# Altium project motor controller board.PrjPcb
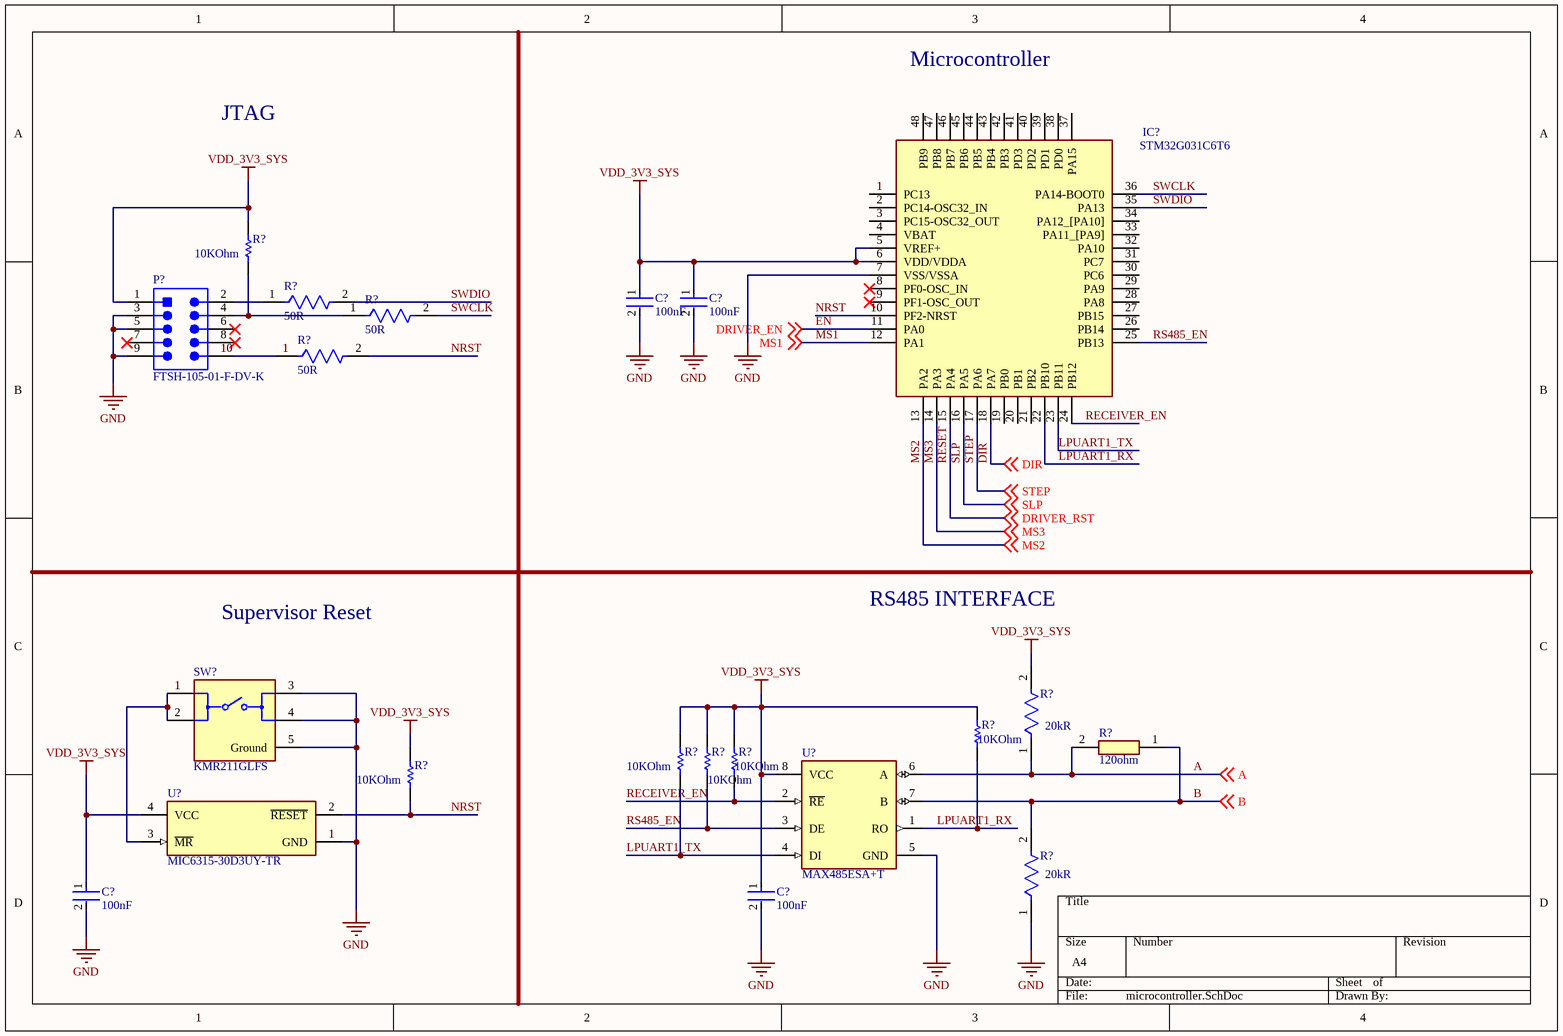
[diagram p0: microcontroller.SchDoc]
4 sheets, 56 parts. Net scope: global (net labels, ports and power ports of the same name join across sheets).
Sheets:
  microcontroller.SchDoc
  Driver.SchDoc
  PowerSupply.SchDoc
  Plugs.SchDoc

## Sheet microcontroller.SchDoc
size A4; SheetNumber: 1; SheetTotal: 3; SPICEModelCacheLTWMIPXS: <root> / <DocumentId>LTWMIPXS</DocumentId> / </root>

### Parts
(Parts that share a designator on the sheet are numbered #1, #2 ... from top to bottom, then left to right.)
C?#1  Capacitance: 100nF  [FP-CGA3E-0_3-0_1-IPC_A]  (hidden comment: CGA3E2X7R1H104K080AA)
C?#2  Capacitance: 100nF  [FP-CGA3E-0_3-0_1-IPC_A]  (hidden comment: CGA3E2X7R1H104K080AA)
C?#3  Capacitance: 100nF  [FP-CGA3E-0_3-0_1-IPC_A]  (hidden comment: CGA3E2X7R1H104K080AA)
C?#4  Capacitance: 100nF  [FP-CGA3E-0_3-0_1-IPC_A]  (hidden comment: CGA3E2X7R1H104K080AA)
IC?#1  STM32G031C6T6  [QFP50P900X900X160-48N]
P?  FTSH-105-01-F-DV-K  [SMTC-FTSH-105-01-L-DV-K_V]
R?#1  Resistance: 10KOhm  [RESC1609X55X30LL15T15]  (hidden comment: ERJ3EKF1002V)
R?#2  Resistance: 50R  [FP-FC0603-MFG]  (hidden comment: FC0603E50R0BTBST1)
R?#3  Resistance: 50R  [FP-FC0603-MFG]  (hidden comment: FC0603E50R0BTBST1)
R?#4  Resistance: 50R  [FP-FC0603-MFG]  (hidden comment: FC0603E50R0BTBST1)
R?#5  Resistance: 10KOhm  [RESC1609X55X30LL15T15]  (hidden comment: ERJ3EKF1002V)
R?#6  value 120ohm  [RESC1608X55N]  (hidden comment: CRG0603F120R)
R?#7  Resistance: 20kR  [FP-RC0603-0_55-IPC_B]  (hidden comment: RC0603FR-0720KL)
R?#8  Resistance: 10KOhm  [RESC1609X55X30LL15T15]  (hidden comment: ERJ3EKF1002V)
R?#9  Resistance: 10KOhm  [RESC1609X55X30LL15T15]  (hidden comment: ERJ3EKF1002V)
R?#10  Resistance: 10KOhm  [RESC1609X55X30LL15T15]  (hidden comment: ERJ3EKF1002V)
R?#11  Resistance: 10KOhm  [RESC1609X55X30LL15T15]  (hidden comment: ERJ3EKF1002V)
R?#12  Resistance: 20kR  [FP-RC0603-0_55-IPC_B]  (hidden comment: RC0603FR-0720KL)
SW?  KMR211GLFS  [FP-KMR211GLFS-MFG]
U?#1  MAX485ESA+T  [FP-S8-2-MFG]
U?#2  MIC6315-30D3UY-TR  [FP-SOT143-4LD-PL-1-MFG]

### Nets
GND: C?#1.2 C?#2.2 C?#3.2 C?#4.2 IC?#1.7(VSS/VSSA) P?.3 P?.5 P?.9 R?#12.1 SW?.3 SW?.4 SW?.5(Ground) U?#1.5(GND) U?#2.1(GND)
VDD_3V3_SYS: C?#1.1 C?#2.1 C?#3.1 C?#4.1 IC?#1.5(VREF+) IC?#1.6(VDD/VDDA) P?.1 R?#1.2 R?#5.2 R?#7.2 R?#8.2 R?#9.2 R?#10.2 R?#11.2 U?#1.8(VCC) U?#2.4(VCC)
A: R?#6.2 R?#7.1 U?#1.6(A) ; off-sheet A
B: R?#6.1 R?#12.2 U?#1.7(B) ; off-sheet B
DIR: IC?#1.18(PA7) ; off-sheet DIR
DRIVER_EN: IC?#1.11(PA0) ; off-sheet DRIVER_EN  [also labelled EN]
DRIVER_RST: IC?#1.15(PA4) ; off-sheet DRIVER_RST  [also labelled RESET]  [project net DRIVER_RESET]
LPUART1_RX: IC?#1.22(PB10) R?#5.1 U?#1.1(RO)
LPUART1_TX: IC?#1.23(PB11) R?#8.1 U?#1.4(DI)
MS1: IC?#1.12(PA1) ; off-sheet MS1
MS2: IC?#1.13(PA2) ; off-sheet MS2
MS3: IC?#1.14(PA3) ; off-sheet MS3
NRST: IC?#1.10(PF2-NRST) R?#4.2 R?#11.1 U?#2.2(~{RESET})
RECEIVER_EN: IC?#1.24(PB12) R?#10.1 U?#1.2(~{RE})
RS485_EN: IC?#1.25(PB13) R?#9.1 U?#1.3(DE)
SLP: IC?#1.16(PA5) ; off-sheet SLP
STEP: IC?#1.17(PA6) ; off-sheet STEP
SWCLK: IC?#1.36(PA14-BOOT0) R?#3.2
SWDIO: IC?#1.35(PA13) R?#2.2
NetP?_2: P?.2 R?#2.1
NetP?_4: P?.4 R?#1.1 R?#3.1
NetP?_10: P?.10 R?#4.1
NetSW?_1: SW?.1 SW?.2 U?#2.3(~{MR})

Not connected (* = marked no-connect by the designer): IC?#1 1(PC13) 2(PC14-OSC32_IN) 3(PC15-OSC32_OUT) 4(VBAT) 8(PF0-OSC_IN)* 9(PF1-OSC_OUT)* 19(PB0) 20(PB1) 21(PB2) 26(PB14) 27(PB15) 28(PA8) 29(PA9) 30(PC6) 31(PC7) 32(PA10) 33(PA11_[PA9]) 34(PA12_[PA10]) 37(PA15) 38(PD0) 39(PD1) 40(PD2) 41(PD3) 42(PB3) 43(PB4) 44(PB5) 45(PB6) 46(PB7) 47(PB8) 48(PB9); P? 6* 7* 8*

### Notes on the sheet
- Microcontroller
- JTAG
- Supervisor Reset
- RS485 INTERFACE

### Library data of the parts
C?#1-C?#4 = CMP-2000-07546-2: Cap Ceramic 100nF 50V X7R 10% Pad SMD 0603 +125°C Automotive T/R; Weight: 7.1E-05oz; Composition: Ceramic; Max Operating Temperature: 125°C; Termination: SMD/SMT; Dielectric: X7R; Length: 1.6mm; Package Quantity: 1; REACH SVHC: No SVHC; Lead Free: Lead Free; Case Code (Metric): 1608; Min Operating Temperature: -55°C; Packaging: Tape and Reel; Tolerance: 10%; Voltage Rating: 50V; Case Code (Imperial): 0603; Case/Package: 0603; Voltage Rating (DC): 50V; Depth: 0.8mm; Radiation Hardening: No; Ratings: AEC-Q200; Mount: Surface Mount; Voltage: 50V; Thickness: 0.035inch; Width: 0.8mm; Height: 0.8mm
IC?#1 = STM32G031C6T6: Integrated Circuit; Manufacturer_Name: STMicroelectronics; Datasheet Link: https://www.st.com/resource/en/datasheet/stm32g031c6.pdf; Height: 1.6mm; Manufacturer_Part_Number: STM32G031C6T6; Mouser Part Number: 511-STM32G031C6T6; Mouser Price/Stock: https://www.mouser.co.uk/ProductDetail/STMicroelectronics/STM32G031C6T6?qs=uwxL4vQweFMtqlIt%2FRk%2Fog%3D%3D; Arrow Part Number: STM32G031C6T6; Arrow Price/Stock: https://www.arrow.com/en/products/stm32g031c6t6/stmicroelectronics?region=nac
P? = CMP-2000-05352-1: Male Header, Pitch 1.27 mm, 2 x 5 Position, Height 6.12 mm, RoHS, Tube; Manufacturer: Samtec; Number of Positions: 10; Connector Type: Header,Shrouded; Number of Positions Loaded: All; Row Spacing: 0.050"(1.27mm); Fastening Type: -; Package Reference: FTSH-105-01-L-DV-K; Termination: Solder; Package URL: http://suddendocs.samtec.com/prints/ftsh-1xx-xx-xxx-dv-xxx-footprint.pdf; Number of Rows: 2; Contact Finish Thickness: 3µin(0.08µm); Contact Type: MalePin; Manufacturer URL: http://www.samtec.com/; Contact Mating Length: 0.120"(3.05mm); Pitch: 0.050"(1.27mm); Series: FTSH; Features: -; Contact Finish: Gold; Color: Black; Family: RectangularConnectors-Headers,MalePins; Datasheet URL: http://suddendocs.samtec.com/prints/ftsh-1xx-xx-xxx-dv-xxx-mkt.pdf; Package Description: Male Header, Pitch 1.27 mm, 2 x 5 Position, Height 5.97 mm, Tail Length 4.32 mm; Mounting Type: SurfaceMount; Datasheet Version: Rev. ET, 10/1995; Category: Connectors,Interconnects; Packaging: Tube
R?#1 R?#5 R?#8-R?#11 = CMP-1012-00623-3: Chip Resistor, 10 KOhm, +/- 1%, 0.1 W, -55 to 155 degC, 0603 (1608 Metric), RoHS, Tape and Reel; Manufacturer: Panasonic; Voltage Rating: 75V; Case\/Package: 0603; Power Rating: 100mW; Temperature Coefficient: 100ppm\/degreesC; Number of Pins: 2; Package Reference: 603; Depth: 0.8mm; Mount: SurfaceMount; Package Description: 2-Pin Surface Mount Device, Body 1.6 x 0.85 mm; Datasheet Version: 02/2017; Length: 1.6mm; Lead Free: LeadFree; Height: 0.45mm; Number of Terminations: 2; Max Power Dissipation: 100mW; Min Operating Temperature: -55degC; Datasheet URL: https://industrial.panasonic.com/cdbs/www-data/pdf/RDA0000/AOA0000C304.pdf; Termination: SMD/SMT; Case Code (Metric): 1608; Case Code (Imperial): 0603; Tolerance: 1%; Max Operating Temperature: 155degC; RoHSCompliant: true; Voltage Rating (DC): 75V; Radiation Hardening: No; Packaging: TapeandReel; Composition: ThickFilm; Mounting Technology: SurfaceMount; Manufacturer URL: http://www.panasonic.com/; Width: 0.031inch; REACH SVHC: NoSVHC; Contact Plating: Tin; Military Standard: Not; Package Quantity: 1
R?#2-R?#4 = CMP-2000-03661-2: RES SMD 50 OHM 0.1% 1/8W 0603; Max Power Dissipation: 125mW; Voltage Rating (DC): 50V; Frequency: 20GHz; Temperature Coefficient: 25ppm/°C; Construction: Rectangular; Length: 0.064inch; Case/Package: 0603; Mount: Surface Mount; Case Code (Imperial): 0603; Military Standard: Not; Height: 0.015inch; RoHS Compliant: Yes; Depth: 0.81mm; Voltage Rating: 50V; Series: FC; Resistance Tolerance: 0.1%; Number of Terminations: 2; Min Operating Temperature: -55°C; Max Operating Temperature: 125°C; Power Rating: 125mW; Resistor Type: Thin Film; Termination: SMD/SMT; Packaging: Tape and Reel; Number of Pins: 2; Radiation Hardening: No; Width: 0.8mm; Tolerance: 0.1%; Contact Plating: Tin; Package Quantity: 1; Case Code (Metric): 1608
R?#6 = CRG0603F120R: Resistor; Manufacturer_Name: TE Connectivity; Datasheet Link: http://docs-europe.electrocomponents.com/webdocs/13d1/0900766b813d116f.pdf; Height: 0.55mm; Manufacturer_Part_Number: CRG0603F120R; Mouser Part Number: 279-CRG0603F120R; Mouser Price/Stock: https://www.mouser.co.uk/ProductDetail/TE-Connectivity-Holsworthy/CRG0603F120R?qs=VHcS2MTj4gbLzmSJaKDB9g%3D%3D; Arrow Part Number: CRG0603F120R; Arrow Price/Stock: https://www.arrow.com/en/products/crg0603f120r/te-connectivity
R?#7 R?#12 = CMP-2000-06932-2: RES 20K OHM 1% 1/10W 0603; Voltage Rating: 50V; Temperature Coefficient: 100ppm/°C; Power Rating: 100mW; Height: 0.022inch; REACH SVHC: No SVHC; Case Code (Metric): 1608; Depth: 0.8mm; Tolerance: 1%; Min Operating Temperature: -55°C; Series: RC; RoHS Compliant: Yes; Resistor Type: Thick Film; Max Power Dissipation: 100mW; Features: Moisture Resistant; Max Operating Temperature: 155°C; Package Quantity: 1; Size Code: 0603; Packaging: Tape and Reel; Width: 0.031inch; Length: 0.063inch; Military Standard: Not; Technology: THICK FILM; Number of Terminations: 2; Termination: SMD/SMT; Construction: Rectangular; Case/Package: 0603; Number of Pins: 2; Lead Free: Lead Free; Voltage Rating (DC): 50V; Resistance Tolerance: 1%; Case Code (Imperial): 0603
SW? = CMP-10040-000023-1: SWITCH TACTILE SPST-NO 0.05A 32V; Switch Function: Off-Mom; Throw Configuration: SPST; Switch Travel: 0.2mm; Current Rating: 50mA; Illumination Type: Non-Illuminated; Actuator Length: 0.5mm; Power Rating: 1W; Operating Force: 1.2N; Actuator Type: Standard; Mechanical Life: 200000Cycles; REACH SVHC: No SVHC; Voltage Rating (DC): 32V; Length: 2.8mm; Min Operating Temperature: -40°C; Mount: Surface Mount; Max Voltage Rating (DC): 32V; Width: 2.8mm; Depth: 4.6mm; Packaging: Tape and Reel; Lead Free: Lead Free; Contact Material: Silver; Termination: Gull Wing; Package Quantity: 1; Contact Current Rating: 50mA; Orientation: Straight; Max Operating Temperature: 85°C; Radiation Hardening: No; Max Current Rating: 50mA; Contact Plating: Silver
U?#1 = CMP-05679-000009-1: IC TRANSCEIVER HALF 1/1 8SOIC; Manufacturer: Maxim Integrated; Min Supply Voltage: 4.75V; Nominal Supply Current: 0.5mA; Number Of Transmitters: 1; Data Rate: 2.5Mbits/s; Interface: RS-485,RS-422; Standoff Height: 0.1mm; Max Supply Voltage: 5.25V; Simplex Duplex: Half-Duplex; Package: S8-2; Temperature: -40°C to +85°C; Device Class L1: Integrated Circuits (ICs); Footprint Url: https://pdfserv.maximintegrated.com/land_patterns/90-0096.PDF; ComponentLink2URL: https://datasheets.maximintegrated.com/en/ds/MAX1487-MAX491.pdf; Height: 1.75mm; Mouser Description: RS-422/RS-485 Interface IC RS-485/RS-422 Transceiver; Octopart: https://octopart.com/max485esa%2Bt-maxim+integrated-40011239; RoHS: TRUE; ComponentLink2Description: Datasheet; Temperature Range Low: -40°C; Number Of Receivers: 1; Manufacturer Part Number: MAX485ESA+T; Ipc Land Pattern Name: SOIC127P600X155-8; Device Class L3: RS-232 / RS-422 / RS-485 Interface ICs; Automotive: No; Digikey Description: IC TRANSCEIVER HALF 1/1 8SOIC; Temperature Range High: +85°C; Category: IC; Device Class L2: Interface ICs; Lead Free: Yes
U?#2 = CMP-06326-000025-1: IC SUPERVISOR 1 CHANNEL SOT143; Max Reset Threshold Voltage: 3.08V; Max Power Dissipation: 320mW; Watchdog Timer: No; Reset: Active Low; Reset Timeout: 140ms; Min Reset Threshold Voltage: 2.92V; Threshold Voltage: 3V; Operating Supply Current: 5uA; Max Supply Voltage: 5.5V; Number of Elements: 1; Min Supply Voltage: 1V; Power Dissipation: 320mW; Packaging: Tape and Reel; Max Operating Temperature: 85°C; Radiation Hardening: No; Series: -; Type: Simple Reset/Power-On Reset; Case/Package: SOT-143; RoHS Compliant: Yes; Min Operating Temperature: -40°C; Number of Pins: 4; Length: 3.05mm; Mount: Surface Mount; Lead Free: Lead Free; Width: 1.4mm; Reach SVHC Compliant: Yes; Height: 1.02mm; Number of Voltages Monitored: 1

## Sheet Driver.SchDoc
size A4; SheetNumber: 2; SheetTotal: 3; SPICEModelCacheOKJMLVYT: <root> / <DocumentId>OKJMLVYT</DocumentId> / <CacheFrame Number="0"> / <Model Name="umk316abj475_d-t" Kind="CKT"> / <Text>* UMK316ABJ475_D-T     SPICE MODEL  ( General Type ) / *-------------------------------------------------------------------------------------------------------- / * Model Generated by TAIYO YUDEN Corporation (http://www.ty-top.com) / * Version 1.0 / * TAIYO YUDEN Control No. 170508_100817 / * Copyright(c) 2012 TAIYO YUDEN CO.,LTD. All Rights Reserved. / *-------------------------------------------------------------------------------------------------------- / * / * Products Name : Multilayer Ceramic Capacitors / * / * Characteristics : / *     Capacitance : 4.7 uF , Rated Voltage : 50V , TCC : X5R / *     Case Size : 3.2 x 1.6 / 0.126 x 0.063 [mm/inch] , Thickness : 0.85 / 0.033 [mm/inch] / *     (Conditions: Temperature = 25 degC , DC Bias Current/Voltage = 0A / 0V) / * / * Frequency Range : 40Hz - 3GHz / * / * External Node Assignments : / * / *  1  o---| |---o  2 / * / *-------------------------------------------------------------------------------------------------------- / .SubCkt UMK316ABJ475_D-T 1 2 / **************************** / C0 1 110 4.046u / Cm 1 101 0.35498u / C1 101 102 0.72942u / Rc1 101 102 1.4231k / C2 102 103 0.27925u / Rc2 102 103 264.97 / C3 103 110 8383.9p / Rc3 103 110 5.6062 / C2m 1 301 0.48206u / C21 301 302 2.0783u / Rc21 301 302 4.5272k / C22 302 303 1.8889u / Rc22 302 303 3.5092k / C23 303 304 0.95238u / Rc23 303 304 5.7814k / C24 304 305 1.2242u / Rc24 304 305 227.36 / C25 305 306 0.82814u / Rc25 305 306 293.28 / C26 306 307 0.36607u / Rc26 306 307 80.665 / C27 307 308 0.030054u / Rc27 307 308 60.542 / C28 308 309 0.071245u / Rc28 308 309 14.818 / C29 309 110 1452.9p / Rc29 309 110 9.6886 / Rp0 1 110 21.2765957446809Meg / L0 110 120 0.27785n / Lm 120 130 0.31876n / L1 120 121 0.29686n / RL1 121 130 0.31082 / L2 120 122 0.41816n / RL2 122 130 0.37915 / L3 120 123 0.94452n / RL3 123 130 0.84341 / CR 120 124 0.42709u / LR 124 125 0.73026n / RR 125 130 79.488m / CL 130 140 0.50681p / LL 130 140 0.22381n / RL 130 140 31.219 / Rs 140 2 7.1209m / **************************** / .ends UMK316ABJ475_D-T</Text> / </Model> / </CacheFrame> / </root>
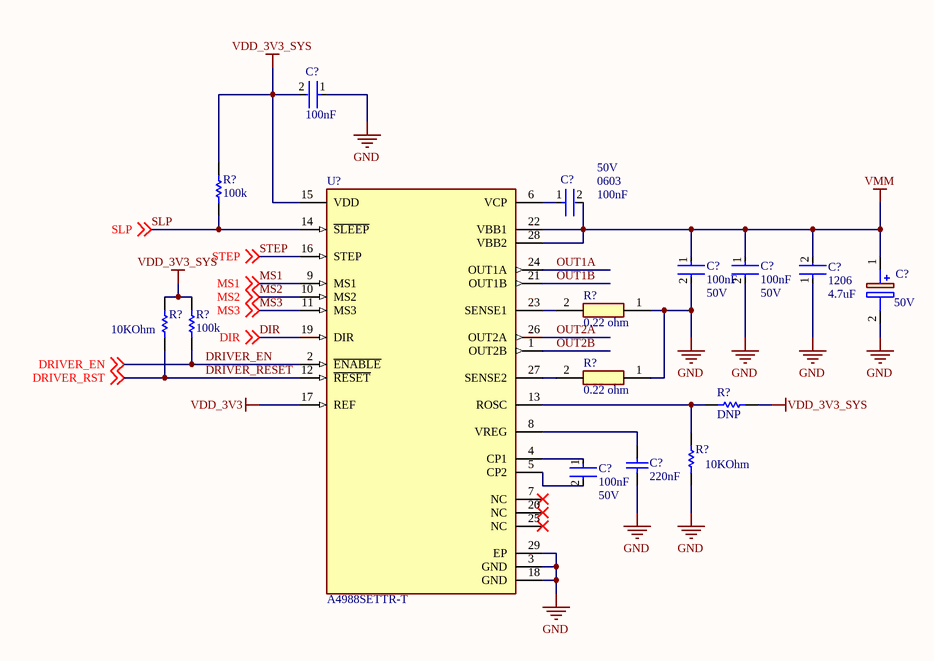
[diagram p1: Driver.SchDoc]

### Parts
(Parts that share a designator on the sheet are numbered #1, #2 ... from top to bottom, then left to right.)
C?#5  Capacitance: 100nF  [FP-CGA3E-0_3-0_1-IPC_A]  (hidden comment: CGA3E2X7R1H104K080AA)
C?#6  Voltage Rating: 50V  Case Code (Imperial): 0603  Capacitance: 100nF  [FP-CGA3E-0_3-0_1-IPC_A]  (hidden comment: CGA3E2X7R1H104K080AA)
C?#7  Capacitance: 100nF  Voltage Rating (DC): 50V  [FP-CGA3E-0_3-0_1-IPC_A]  (hidden comment: CGA3E2X7R1H104K080AA)
C?#8  Capacitance: 100nF  Voltage Rating (DC): 50V  [FP-CGA3E-0_3-0_1-IPC_A]  (hidden comment: CGA3E2X7R1H104K080AA)
C?#9  voltage rating: 50V  [EEE0JA331XP]  (hidden comment: EEE-FK1H470XP)
C?#10  Case/Package: 1206  Capacitance: 4.7uF  [FP-1206-L_3_2_0_2-W_1_6_0-IPC_B]  (hidden comment: UMK316ABJ475KD-T)
C?#11  Capacitance: 100nF  Voltage Rating (DC): 50V  [FP-CGA3E-0_3-0_1-IPC_A]  (hidden comment: CGA3E2X7R1H104K080AA)
C?#12  Parameter 1: 220nF  [CAPC1608X87X35NL15T15]  (hidden comment: C0603C224K8NACTU)
R?#13  value 100k  [RESC1609X55X30ML10T20]  (hidden comment: TNPW0603100KBEEN)
R?#14  value 100k  [RESC1609X55X30ML10T20]  (hidden comment: TNPW0603100KBEEN)
R?#15  value 0.22 ohm  [RESC6432X84N]  (hidden comment: RLP73K3AR22JTE)
R?#16  Resistance: 10KOhm  [RESC1609X55X30LL15T15]  (hidden comment: ERJ3EKF1002V)
R?#17  value 0.22 ohm  [RESC6432X84N]  (hidden comment: RLP73K3AR22JTE)
R?#18  Resistance: DNP  [RESC1608X55X25ML10T15]  (hidden comment: RC0603JR-070RL)  (net tie, no BOM)
R?#19  Resistance: 10KOhm  [RESC1609X55X30LL15T15]  (hidden comment: ERJ3EKF1002V)
U?#3  A4988SETTR-T  [FP-ET-28-MFG]

### Nets
GND: C?#5.1 C?#7.2 C?#8.2 C?#9.2(-) C?#10.1 C?#12.2 R?#15.1 R?#17.1 R?#19.1 U?#3.3(GND) U?#3.18(GND) U?#3.29(EP)
VDD_3V3: U?#3.17(REF)
VDD_3V3_SYS: C?#5.2 R?#13.1 R?#14.1 R?#16.2 R?#18.2 U?#3.15(VDD)
VMM: C?#6.2 C?#7.1 C?#8.1 C?#9.1(+) C?#10.2 U?#3.22(VBB1) U?#3.28(VBB2)
DIR: U?#3.19(DIR) ; off-sheet DIR
DRIVER_EN: R?#14.2 U?#3.2(~{ENABLE}) ; off-sheet DRIVER_EN
DRIVER_RESET: R?#16.1 U?#3.12(~{RESET}) ; off-sheet DRIVER_RST  [also labelled DRIVER_RST]
MS1: U?#3.9(MS1) ; off-sheet MS1
MS2: U?#3.10(MS2) ; off-sheet MS2
MS3: U?#3.11(MS3) ; off-sheet MS3
OUT1A: U?#3.24(OUT1A)
OUT1B: U?#3.21(OUT1B)
OUT2A: U?#3.26(OUT2A)
OUT2B: U?#3.1(OUT2B)
SLP: R?#13.2 U?#3.14(~{SLEEP}) ; off-sheet SLP
STEP: U?#3.16(STEP) ; off-sheet STEP
NetC?#6_1: C?#6.1 U?#3.6(VCP)
NetC?#11_1: C?#11.1 U?#3.4(CP1)
NetC?#11_2: C?#11.2 U?#3.5(CP2)
NetC?#12_1: C?#12.1 U?#3.8(VREG)
NetR?#15_2: R?#15.2 U?#3.23(SENSE1)
NetR?#17_2: R?#17.2 U?#3.27(SENSE2)
NetR?#18_1: R?#18.1 R?#19.2 U?#3.13(ROSC)

Not connected (* = marked no-connect by the designer): U?#3 7(NC)* 20(NC)* 25(NC)*

### Library data of the parts
C?#5-C?#8 C?#11 = CMP-2000-07546-2: as C?#1 on sheet microcontroller; Weight: 7.1E-05oz; Composition: Ceramic; Max Operating Temperature: 125°C; Termination: SMD/SMT; Dielectric: X7R; Length: 1.6mm; Package Quantity: 1; REACH SVHC: No SVHC; Lead Free: Lead Free; Case Code (Metric): 1608; Min Operating Temperature: -55°C; Packaging: Tape and Reel; Tolerance: 10%; Case/Package: 0603; Depth: 0.8mm; Radiation Hardening: No; Ratings: AEC-Q200; Mount: Surface Mount; Voltage: 50V; Thickness: 0.035inch; Width: 0.8mm; Height: 0.8mm
  C?#5: Voltage Rating: 50V; Case Code (Imperial): 0603; Voltage Rating (DC): 50V
  C?#6: Voltage Rating (DC): 50V; Parameter 1: *
  C?#7 C?#8 C?#11: Voltage Rating: 50V; Case Code (Imperial): 0603
C?#9 = EEE-FK1H470XP: Capacitor Polarised; Manufacturer_Name: Panasonic; Datasheet Link: http://industrial.panasonic.com/cdbs/www-data/pdf/RDE0000/ABA0000C1181.pdf; Height: 7.8mm; Manufacturer_Part_Number: EEE-FK1H470XP; Mouser Part Number: 667-EEE-FK1H470XP; Mouser Price/Stock: https://www.mouser.co.uk/ProductDetail/Panasonic/EEE-FK1H470XP?qs=qE6bgDGEOCtuVppQsylaxg%3D%3D; Arrow Part Number: EEE-FK1H470XP; Arrow Price/Stock: https://www.arrow.com/en/products/eee-fk1h470xp/panasonic?region=europe; Parameter 2: *
C?#10 = CMP-14477-000107-2: None; Voltage Rating (DC): 50V; Tolerance: 10%; Dielectric: X5R; Mount: Surface Mount; RoHS Compliant: Yes; Height: 0.85mm; Case Code (Metric): 3216; Construction: Flat; Resistor Type: Ceramic; Number of Pins: 2; Depth: 1.6mm; Packaging: Tape and Reel; Max Operating Temperature: 85°C; Length: 3.2mm; Thickness: 0.037inch; Voltage Rating: 50V; Weight: 0.000571oz; Width: 0.063inch; Case Code (Imperial): 1206; Package Quantity: 1; Termination: SMD/SMT; Series: M; Radiation Hardening: No; Min Operating Temperature: -55°C
C?#12 = CMP-2006-03148-1: Manufacturer: Kemet; Part Number: C0603C224K8NACTU
R?#13 R?#14 = CMP-2000-03686-1: Manufacturer: Vishay Dale; Part Number: TNPW0603100KBEEN
R?#15 R?#17 = RLP73K3AR22JTE: Resistor; Manufacturer_Name: TE Connectivity; Datasheet Link: https://www.te.com/commerce/DocumentDelivery/DDEController?Action=showdoc&DocId=Customer+Drawing%7F2176058%7FBA%7Fpdf%7FEnglish%7FENG_CD_2176058_BA.pdf%7F3-2176058-3; Height: 0.84mm; Manufacturer_Part_Number: RLP73K3AR22JTE; Arrow Part Number: RLP73K3AR22JTE; Arrow Price/Stock: https://www.arrow.com/en/products/rlp73k3ar22jte/te-connectivity
R?#16 R?#19 = CMP-1012-00623-3: as R?#1 on sheet microcontroller; Number of Pins: 2; Package Reference: 603; Depth: 0.8mm; Mount: SurfaceMount; Package Description: 2-Pin Surface Mount Device, Body 1.6 x 0.85 mm; Datasheet Version: 02/2017; Length: 1.6mm; Lead Free: LeadFree; Height: 0.45mm; Number of Terminations: 2; Max Power Dissipation: 100mW; Min Operating Temperature: -55degC; Datasheet URL: https://industrial.panasonic.com/cdbs/www-data/pdf/RDA0000/AOA0000C304.pdf; Termination: SMD/SMT; Case Code (Metric): 1608; Case Code (Imperial): 0603; Tolerance: 1%; Max Operating Temperature: 155degC; RoHSCompliant: true; Voltage Rating (DC): 75V; Radiation Hardening: No; Packaging: TapeandReel; Composition: ThickFilm; Mounting Technology: SurfaceMount; Manufacturer URL: http://www.panasonic.com/; Width: 0.031inch; REACH SVHC: NoSVHC; Contact Plating: Tin; Military Standard: Not; Package Quantity: 1
R?#18 = CMP-2100-03667-1: Chip Resistor, 0 Ohm, +/- 5%, 0.1 W, -55 to 155 degC, 0603 (1608 Metric), RoHS, Tape and Reel; Manufacturer: Yageo; Temperature Coefficient: 200ppm/degreesC; Voltage Rating: 50V; Power Rating: 100mW; Width: 0.8mm; Max Operating Temperature: 155degC; Tolerance: 5%; Package Reference: 0603; Height: 0.45mm; Depth: 0.8mm; Package Description: 2-Pin Surface Mount Device, Body 1.6 x 0.8 mm; Termination: SMD/SMT; Package Quantity: 5000; Case/Package: 0603; Case Code (Imperial): 0603; Radiation Hardening: No; Number of Pins: 2; Length: 1.6mm; Lead Free: LeadFree; Voltage Rating (DC): 50V; Military Standard: Not; Datasheet URL: http://www.yageo.com/NewPortal/yageodocoutput?fileName=/pdf/R-Chip/PYu-RC_Group_51_RoHS_L_5.pdf; Manufacturer URL: http://www.yageo.com/; Packaging: TapeandReel; Case Code (Metric): 1608; Min Operating Temperature: -55degC; Composition: ThickFilm; RoHSCompliant: true; Contact Plating: Tin; Datasheet Version: Rev. 5, 10/2016; REACH SVHC: NoSVHC
U?#3 = CMP-1742-00003-2: IC MTR DRVR BIPOLAR 3-5.5V 28QFN; Number of Outputs: 1; Motor Type: Stepper; Output Current: 2A; Min Supply Voltage: 8V; Output Voltage: 35V; Package Quantity: 1; Max Operating Temperature: 85°C; Case/Package: QFN EP; Mount: Surface Mount; Packaging: Tape and Reel; Radiation Hardening: No; REACH SVHC: No SVHC; Min Operating Temperature: -20°C; Max Supply Voltage: 35V; Number of Pins: 28

## Sheet PowerSupply.SchDoc
size A4; SheetNumber: 3; SheetTotal: 3
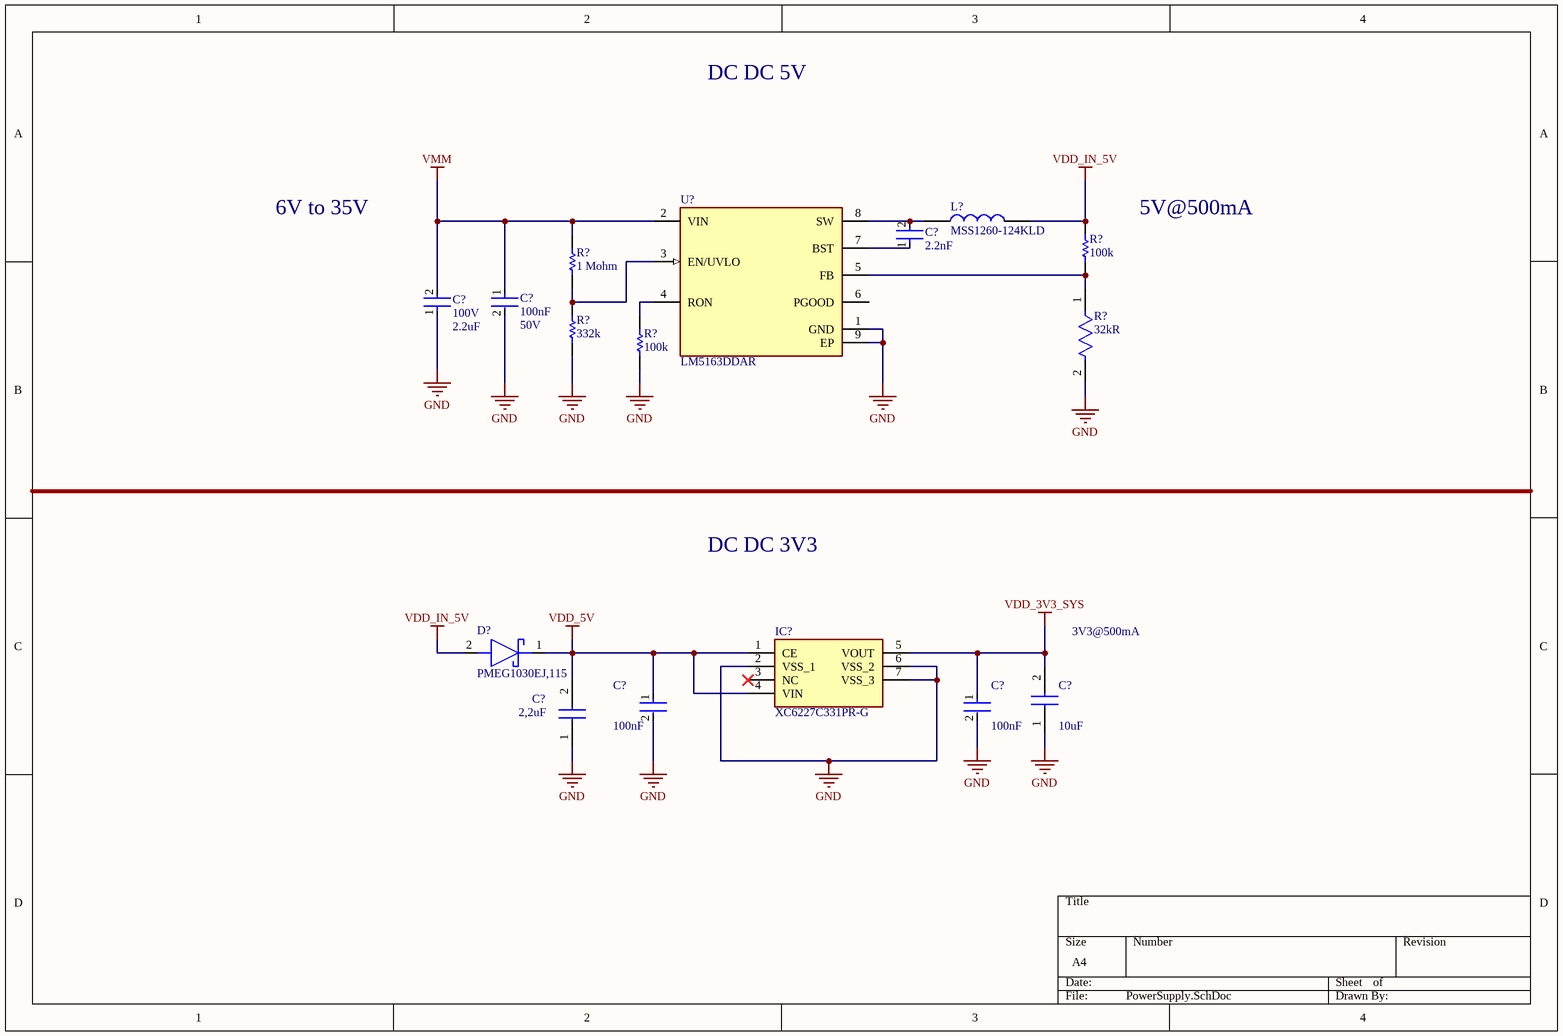
[diagram p2: PowerSupply.SchDoc]

### Parts
(Parts that share a designator on the sheet are numbered #1, #2 ... from top to bottom, then left to right.)
C?#13  Capacitance: 2.2nF  [FP-GCM155-0_05-IPC_C]  (hidden comment: GCM155R71H222KA37D)
C?#14  Capacitance: 100nF  Voltage Rating (DC): 50V  [FP-CGA3E-0_3-0_1-IPC_A]  (hidden comment: CGA3E2X7R1H104K080AA)
C?#15  Voltage Rating: 100V  Capacitance: 2.2uF  [FP-CGA6P-IPC_B]  (hidden comment: CGA6N3X7R2A225K230AB)
C?#16  Capacitance: 100nF  [FP-CGA3E-0_3-0_1-IPC_B]  (hidden comment: CGA3E2X7R1H104K080AA)
C?#17  Capacitance: 100nF  [FP-CGA3E-0_3-0_1-IPC_B]  (hidden comment: CGA3E2X7R1H104K080AA)
C?#18  value 10uF  [C0805]  (hidden comment: C0805C106K4PACTU)
C?#19  value 2,2uF  [CAPC2012X135N]  (hidden comment: GRM21BR60J225KA01L)
D?  PMEG1030EJ,115  [SODFL2512X80N]
IC?#2  XC6227C331PR-G  [XC6227C501PRG]
L?  MSS1260-124KLD  [INDPM122123X620N]
R?#20  value 100k  [RESC1609X55X30ML10T20]  (hidden comment: TNPW0603100KBEEN)
R?#21  value 1 Mohm  [RESC1608X55X25LL10T15]  (hidden comment: RC0603FR-071ML)
R?#22  Resistance: 32kR  [FP-RN731J-IPC_B]  (hidden comment: RN731JTTD3202F100)
R?#23  value 332k  [RESC1608X55X25NL10T15]  (hidden comment: RC0603FR-07332KL)
R?#24  value 100k  [RESC1609X55X30ML10T20]  (hidden comment: TNPW0603100KBEEN)
U?#4  LM5163DDAR  [FP-DDA0008E-IPC_C]

### Nets
GND: C?#14.2 C?#15.1 C?#16.2 C?#17.2 C?#18.1 C?#19.1 IC?#2.2(VSS_1) IC?#2.6(VSS_2) IC?#2.7(VSS_3) R?#22.2 R?#23.2 R?#24.2 U?#4.1(GND) U?#4.9(EP)
VDD_3V3_SYS: C?#17.1 C?#18.2 IC?#2.5(VOUT)
VDD_5V: C?#16.1 C?#19.2 D?.1(K) IC?#2.1(CE) IC?#2.4(VIN)
VDD_IN_5V: D?.2(A) L?.2 R?#20.1
VMM: C?#14.1 C?#15.2 R?#21.1 U?#4.2(VIN)
NetC?#13_1: C?#13.1 U?#4.7(BST)
NetC?#13_2: C?#13.2 L?.1 U?#4.8(SW)
NetR?#20_2: R?#20.2 R?#22.1 U?#4.5(FB)
NetR?#21_2: R?#21.2 R?#23.1 U?#4.3(EN/UVLO)
NetR?#24_1: R?#24.1 U?#4.4(RON)

Not connected (* = marked no-connect by the designer): IC?#2 3(NC)*; U?#4 6(PGOOD)

### Notes on the sheet
- DC DC 5V
- 6V to 35V
- 5V@500mA
- DC DC 3V3
- 3V3@500mA

### Library data of the parts
C?#13 = CMP-2008-03727-2: Ceramic Capacitor for Automotive 2.2nF ±10% 50VDC X7R 0402 Paper T/R; Voltage: 50V; Max Operating Temperature: 125°C; Dielectric: X7R; Height: 0.5mm; Case/Package: 0402; Case Code (Metric): 1005; Min Operating Temperature: -55°C; Packaging: Tape and Reel; Mount: Surface Mount; Depth: 0.5mm; Ratings: AEC-Q200; Lead Free: Lead Free; Radiation Hardening: No; Termination: SMD/SMT; Voltage Rating: 50V; Tolerance: 10%; Length: 1mm; Case Code (Imperial): 0402; Weight: 2.3E-05oz; Package Quantity: 1; Thickness: 0.022inch; Voltage Rating (DC): 50V; Width: 0.02inch
C?#14 C?#16 C?#17 = CMP-2000-07546-2: as C?#1 on sheet microcontroller; Weight: 7.1E-05oz; Composition: Ceramic; Max Operating Temperature: 125°C; Termination: SMD/SMT; Dielectric: X7R; Length: 1.6mm; Package Quantity: 1; REACH SVHC: No SVHC; Lead Free: Lead Free; Case Code (Metric): 1608; Min Operating Temperature: -55°C; Packaging: Tape and Reel; Tolerance: 10%; Voltage Rating: 50V; Case Code (Imperial): 0603; Case/Package: 0603; Depth: 0.8mm; Radiation Hardening: No; Ratings: AEC-Q200; Mount: Surface Mount; Voltage: 50V; Thickness: 0.035inch; Width: 0.8mm; Height: 0.8mm
  C?#16 C?#17: Voltage Rating (DC): 50V; Parameter 1: *
C?#15 = CMP-08246-002435-1: Cap Ceramic 2.2uF 100V X7R 10% Pad SMD 1210 +125°C Automotive T/R; Length: 3.2mm; Width: 0.098inch; Mount: Surface Mount; Ratings: AEC-Q200; Case Code (Imperial): 1210; Case Code (Metric): 3225; Case/Package: 1210; Packaging: Tape and Reel; Thickness: 0.098inch; Max Operating Temperature: 125°C; Depth: 2.5mm; Min Operating Temperature: -55°C; Voltage Rating (DC): 100V; Height: 2.3mm; Weight: 0.000564oz; Package Quantity: 1; Tolerance: 10%; REACH SVHC: No SVHC; Termination: SMD/SMT; Lead Free: Lead Free; Dielectric: X7R; Composition: Ceramic
C?#18 = C0805C106K4PACTU: Capacitor; Manufacturer_Name: KEMET; Datasheet Link: https://content.kemet.com/datasheets/KEM_C1006_X5R_SMD.pdf; Height: 1.1mm; Manufacturer_Part_Number: C0805C106K4PACTU; Mouser Part Number: 80-C0805C106K4P; Mouser Price/Stock: https://www.mouser.co.uk/ProductDetail/KEMET/C0805C106K4PACTU?qs=LOQsJ2JwiRQzQlGR%2F0Z13g%3D%3D; Arrow Part Number: C0805C106K4PACTU; Arrow Price/Stock: https://www.arrow.com/en/products/c0805c106k4pactu/kemet-corporation
C?#19 = GRM21BR60J225KA01L: Capacitor; Manufacturer_Name: Murata Electronics; Datasheet Link: https://www.murata.com/en-global/products/productdetail?partno=GRM21BR60J225KA01%23; Height: 1.35mm; Manufacturer_Part_Number: GRM21BR60J225KA01L; Mouser Part Number: 81-GRM21R60J225KA01L; Mouser Price/Stock: https://www.mouser.co.uk/ProductDetail/Murata-Electronics/GRM21BR60J225KA01L?qs=DJY02EClX9mNbSy8m7mkKA%3D%3D; Arrow Part Number: GRM21BR60J225KA01L; Arrow Price/Stock: https://www.arrow.com/en/products/grm21br60j225ka01l/murata-manufacturing
D? = PMEG1030EJ,115: Schottky Diode; Manufacturer_Name: Nexperia; Datasheet Link: https://assets.nexperia.com/documents/data-sheet/PMEG1030EH_EJ.pdf; Height: 0.8mm; ManufacturerPart_Number: PMEG1030EJ,115; Mouser Part Number: 771-PMEG1030EJ-T/R; Mouser Price/Stock: https://www.mouser.co.uk/ProductDetail/Nexperia/PMEG1030EJ115?qs=LOCUfHb8d9vmk7P%2FuYbs5A%3D%3D; Arrow Part Number: PMEG1030EJ,115; Arrow Price/Stock: https://www.arrow.com/en/products/pmeg1030ej115/nexperia?region=asia
IC?#2 = XC6227C331PR-G: Integrated Circuit; Manufacturer_Name: Torex; Datasheet Link: https://www.torexsemi.com/file/xc6227/XC6227.pdf; Height: 1.6mm; Manufacturer_Part_Number: XC6227C331PR-G; Mouser Part Number: 865-XC6227C331PR-G; Mouser Price/Stock: https://www.mouser.co.uk/ProductDetail/Torex-Semiconductor/XC6227C331PR-G?qs=AsjdqWjXhJ9DrPcUjKBVyw%3D%3D
L? = MSS1260-124KLD: Fixed Inductors 120uH Shld 10% 1.85A 195mOhms AECQ2; Manufacturer_Name: COILCRAFT; Geometry.Height: 6.2mm; Manufacturer_Part_Number: MSS1260-124KLD; Mouser Part Number: 994-MSS1260-124KLD; Mouser Price/Stock: https://www.mouser.co.uk/ProductDetail/Coilcraft/MSS1260-124KLD?qs=zCSbvcPd3paKD%252BcMw7fang%3D%3D; Arrow Part Number: *; Arrow Price/Stock: *; Datasheet Link: http://www.farnell.com/datasheets/1681951.pdf?_ga=2.3114224.1184920619.1597749177-523797770.1571638354
R?#20 R?#24 = CMP-2000-03686-1: Manufacturer: Vishay Dale; Part Number: TNPW0603100KBEEN
R?#21 = CMP-1659-00056-1: Chip Resistor, 1 MOhm, +/- 1%, 100 mW, -55 to 155 degC, 0603 (1608 Metric), RoHS, Tape and Reel; Voltage Rating (DC): 25 V; Tolerance: 20%; Case\Package: Radial; Min Operating Temperature: -40 degC; PackageDescription: 2-Pin Surface Mount Device, Body 1.6 x 0.8 mm; ComponentLink1Description: Manufacturer URL; Radiation Hardening: No; DatasheetVersion: Rev. 4, 02/2016; REACH SVHC: No SVHC; Length: 20 mm; Max Operating Temperature: 85 degC; Diameter: 10 mm; Packaging: Bulk; Package Quantity: 200; PackageReference: 0603; Mount: Through Hole; ComponentLink1URL: http://www.yageo.com/; ComponentLink2URL: http://www.yageo.com/documents/recent/PYu-RC_Group_51_RoHS_L_04.pdf; ComponentLink2Description: Datasheet; Width: 0 inch; Lead Pitch: 5 mm; RoHSCompliant: true; Voltage Rating: 25 V; Height: 20 mm
R?#22 = CMP-04015-052115-1: 32kΩ ±1% 0.063W, 1/16W Chip Resistor 0603 (1608 Metric) Moisture Resistant Thin Film; Temperature Coefficient: 10ppm/°C; Voltage Rating: 50V; Power Rating: 63mW; Case Code (Metric): 1608; Max Operating Temperature: 125°C; Termination: SMD/SMT; Case/Package: 0603; Case Code (Imperial): 0603; Tolerance: 1%; Packaging: Tape and Reel; Min Operating Temperature: -55°C
R?#23 = CMP-1659-00021-2: Chip Resistor, 332 KOhm, +/- 1%, 0.1 W, -55 to 155 degC, 0603 (1608 Metric), RoHS, Tape and Reel; Gender: Female; Voltage Rating: 40 V; Case\Package: Metal; Connector Type: HDMI; Mount: Surface Mount; Packaging: Tape and Reel; ComponentLink1URL: http://www.yageo.com/; Length: 15 mm; Colour: Silver; Height: 14.25 mm; Pins: 19; Package Quantity: 300; PackageReference: 0603; Contact Plating: Gold; ComponentLink2URL: http://www.yageo.com/documents/recent/PYu-RC_Group_51_RoHS_L_04.pdf; Lead Pitch: 0.5 mm; Width: 11.55 mm; ComponentLink2Description: Datasheet; PackageDescription: 2-Pin Surface Mount Device, Body 1.6 x 0.8 mm; RoHSCompliant: true; REACH SVHC: No SVHC; DatasheetVersion: Rev. 4, 02/2016; Contact Material: Copper; ComponentLink1Description: Manufacturer URL
U?#4 = CMP-04918-000374-1: LM5163 PRODUCTION COMMERCIAL

## Sheet Plugs.SchDoc
size A4; SheetNumber: 4; SheetTotal: 4
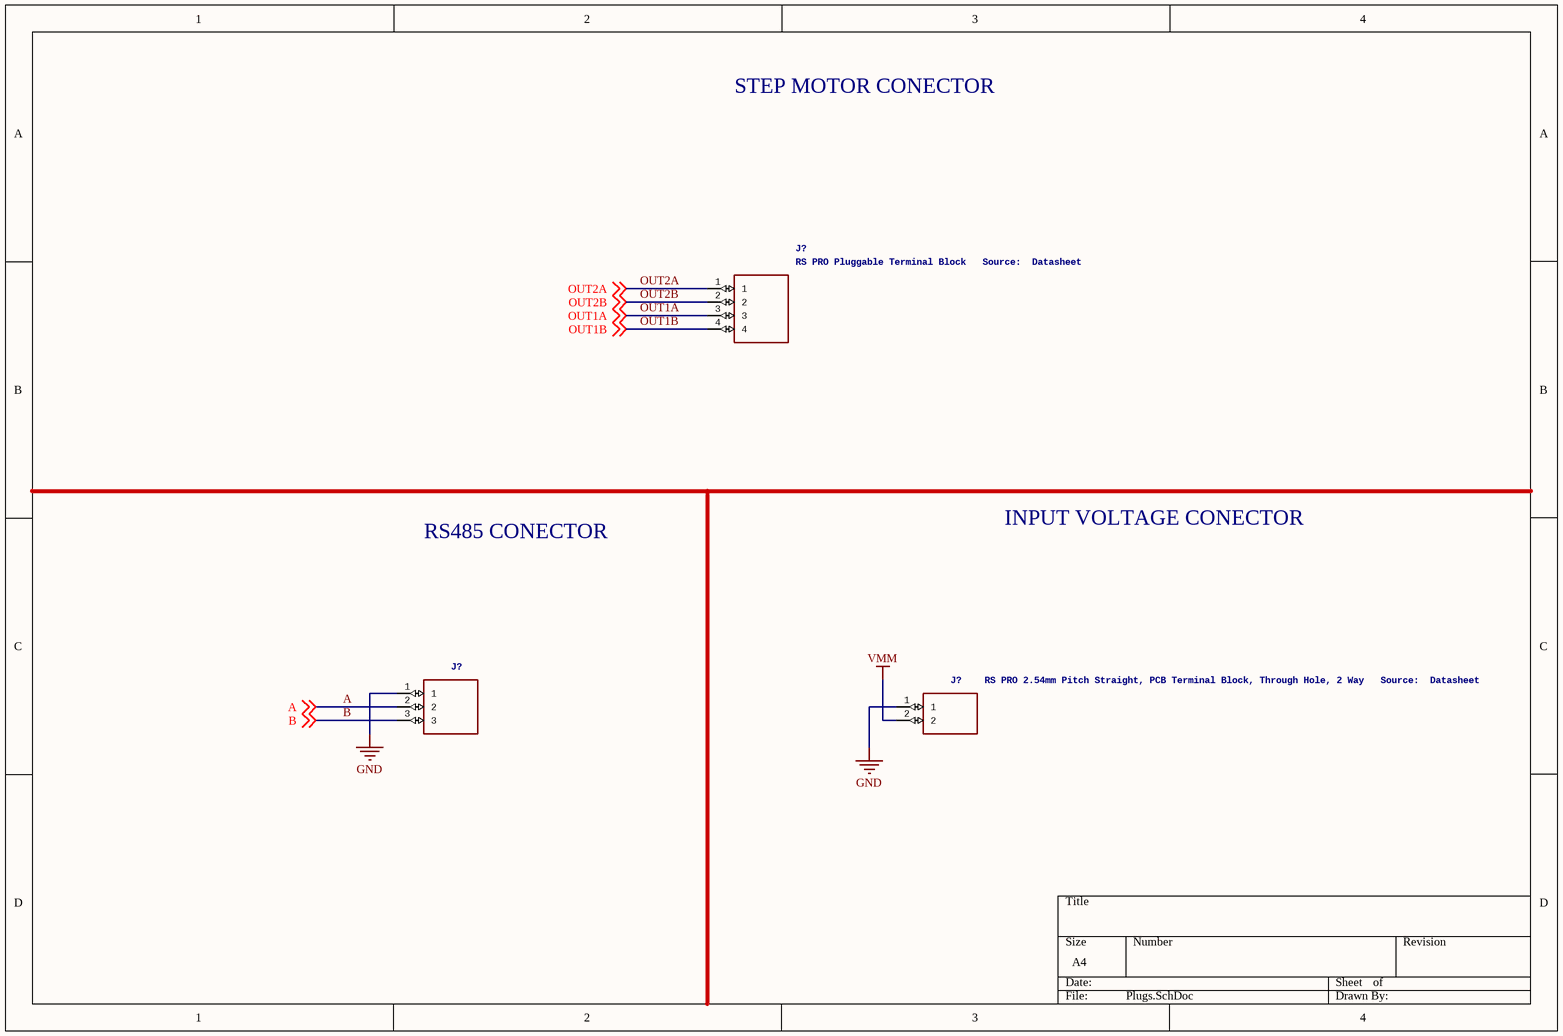
[diagram p3: Plugs.SchDoc]

### Parts
(Parts that share a designator on the sheet are numbered #1, #2 ... from top to bottom, then left to right.)
J?#1  RS PRO Pluggable Terminal Block   Source:  Datasheet  [CTBP20544]
J?#2  RS PRO 2.54mm Pitch Straight, PCB Terminal Block, Through Hole, 3 Way   Source:  Datasheet  [MB31225403NIP]  (value not drawn)
J?#3  RS PRO 2.54mm Pitch Straight, PCB Terminal Block, Through Hole, 2 Way   Source:  Datasheet  [MB31225402NIP]

### Nets
GND: J?#2.1 J?#3.1
VMM: J?#3.2
A: J?#2.2 ; off-sheet A
B: J?#2.3 ; off-sheet B
OUT1A: J?#1.3 ; off-sheet OUT1A
OUT1B: J?#1.4 ; off-sheet OUT1B
OUT2A: J?#1.1 ; off-sheet OUT2A
OUT2B: J?#1.2 ; off-sheet OUT2B

### Notes on the sheet
- STEP MOTOR CONECTOR
- RS485 CONECTOR
- INPUT VOLTAGE CONECTOR

### Library data of the parts
J?#1 = CTBP2054_4: Manufacturer_Name: RS Components; Manufacturer_Part_Number: CTBP2054/4; GateName_1: G$1; SymbolName_1: CTBP2054_4; LibraryName: CTBP2054_4; DeviceSetName: CTBP2054_4; RS_Part_Number: 1731623; RS_Price-Stock: https://uk.rs-online.com/web/p/products/1731623; Height: 8.5mm
J?#2 = MB312-25403NIP: Manufacturer_Name: RS Components; GateName_1: G$1; SymbolName_1: MB312-25403NIP; LibraryName: MB312-25403NIP; DeviceSetName: MB312-25403NIP; RS_Part_Number: 7901092; RS_Price-Stock: https://uk.rs-online.com/web/p/products/7901092; Manufacturer_Part_Number: MB312-25403NIP; Height: 8.8mm
J?#3 = MB312-25402NIP: Manufacturer_Name: RS Components; GateName_1: G$1; SymbolName_1: MB312-25402NIP; LibraryName: MB312-25402NIP; DeviceSetName: MB312-25402NIP; RS_Part_Number: 7901098; RS_Price-Stock: https://uk.rs-online.com/web/p/products/7901098; Manufacturer_Part_Number: MB312-25402NIP; Height: 8.8mm

## Nets that join several sheets
GND: microcontroller (14 pins), Driver (12 pins), PowerSupply (14 pins), Plugs (J?#2.1 J?#3.1)
VDD_3V3_SYS: microcontroller (16 pins), Driver (6 pins), PowerSupply (C?#17.1 C?#18.2 IC?#2.5)
VMM: Driver (7 pins), PowerSupply (C?#14.1 C?#15.2 R?#21.1 U?#4.2), Plugs (J?#3.2)
A: microcontroller (R?#6.2 R?#7.1 U?#1.6), Plugs (J?#2.2)
B: microcontroller (R?#6.1 R?#12.2 U?#1.7), Plugs (J?#2.3)
DIR: microcontroller (IC?#1.18), Driver (U?#3.19)
DRIVER_EN: microcontroller (IC?#1.11), Driver (R?#14.2 U?#3.2)
DRIVER_RESET: microcontroller (IC?#1.15), Driver (R?#16.1 U?#3.12)
MS1: microcontroller (IC?#1.12), Driver (U?#3.9)
MS2: microcontroller (IC?#1.13), Driver (U?#3.10)
MS3: microcontroller (IC?#1.14), Driver (U?#3.11)
OUT1A: Driver (U?#3.24), Plugs (J?#1.3)
OUT1B: Driver (U?#3.21), Plugs (J?#1.4)
OUT2A: Driver (U?#3.26), Plugs (J?#1.1)
OUT2B: Driver (U?#3.1), Plugs (J?#1.2)
SLP: microcontroller (IC?#1.16), Driver (R?#13.2 U?#3.14)
STEP: microcontroller (IC?#1.17), Driver (U?#3.16)